# Altium schematic sheet AFE.SchDoc
size A4; SheetNumber: 3; SheetTotal: 5
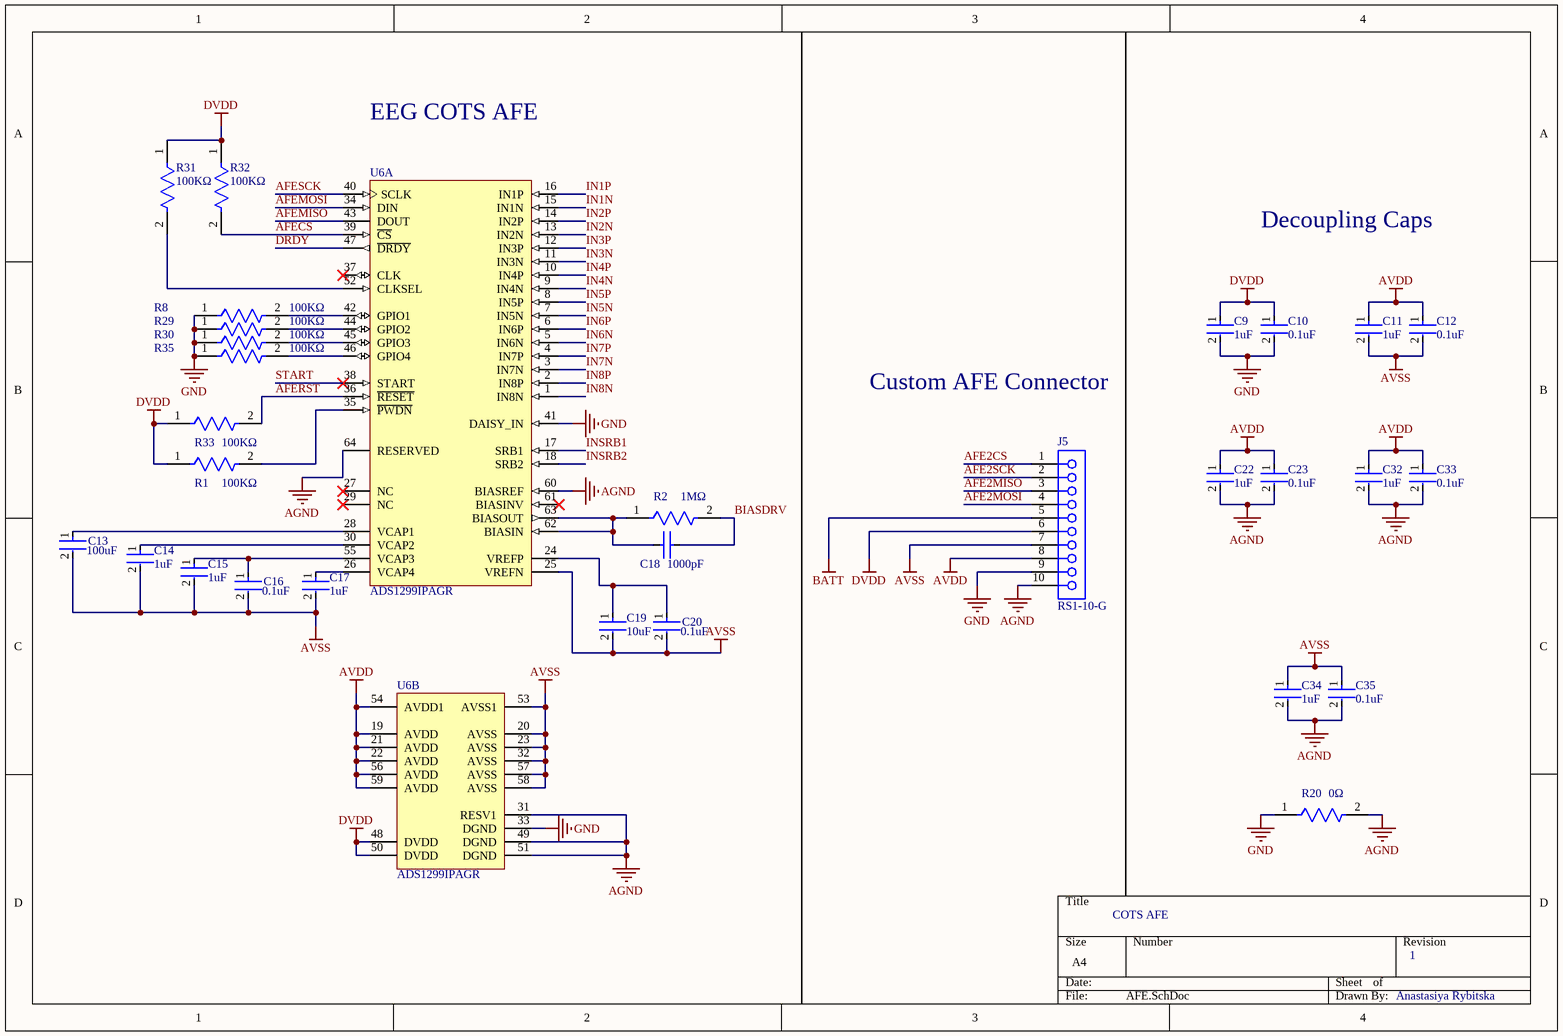
[diagram p0: AFE.SchDoc]

## Parts
C9  Capacitance: 1uF  [FP-CL10-IPC_C]  (hidden comment: CL10A105KA8NNNC)
C10  Capacitance: 0.1uF  [FP-0603-L_1_6_0_15-W_0_81-MFG]  (hidden comment: KGM15BR71H104JT)
C11  Capacitance: 1uF  [FP-CL10-IPC_C]  (hidden comment: CL10A105KA8NNNC)
C12  Capacitance: 0.1uF  [FP-0603-L_1_6_0_15-W_0_81-MFG]  (hidden comment: KGM15BR71H104JT)
C13  Capacitance: 100uF  [FP-GRM21B-0_2-e0_2_0_7-IPC_A]  (hidden comment: GRM21BR60E107ME15K)
C14  Capacitance: 1uF  [FP-CL10-IPC_C]  (hidden comment: CL10A105KA8NNNC)
C15  Capacitance: 1uF  [FP-CL10-IPC_C]  (hidden comment: CL10A105KA8NNNC)
C16  Capacitance: 0.1uF  [FP-0603-L_1_6_0_15-W_0_81-MFG]  (hidden comment: KGM15BR71H104JT)
C17  Capacitance: 1uF  [FP-CL10-IPC_C]  (hidden comment: CL10A105KA8NNNC)
C18  Capacitance: 1000pF  [CAP_0603_S_WAL]  (hidden comment: 0603N102F500CT)
C19  Capacitance: 10uF  [FP-CL10-IPC_C]  (hidden comment: CL10A106MQ8NNNC)
C20  Capacitance: 0.1uF  [FP-0603-L_1_6_0_15-W_0_81-MFG]  (hidden comment: KGM15BR71H104JT)
C22  Capacitance: 1uF  [FP-CL10-IPC_C]  (hidden comment: CL10A105KA8NNNC)
C23  Capacitance: 0.1uF  [FP-0603-L_1_6_0_15-W_0_81-MFG]  (hidden comment: KGM15BR71H104JT)
C32  Capacitance: 1uF  [FP-CL10-IPC_C]  (hidden comment: CL10A105KA8NNNC)
C33  Capacitance: 0.1uF  [FP-0603-L_1_6_0_15-W_0_81-MFG]  (hidden comment: KGM15BR71H104JT)
C34  Capacitance: 1uF  [FP-CL10-IPC_C]  (hidden comment: CL10A105KA8NNNC)
C35  Capacitance: 0.1uF  [FP-0603-L_1_6_0_15-W_0_81-MFG]  (hidden comment: KGM15BR71H104JT)
J5  RS1-10-G  [61301011821]
R1  Resistance: 100KΩ  [FP-RMCF0603-IPC_C]  (hidden comment: RMCF0603FT100K)
R2  Resistance: 1MΩ  [FP-ERJ3EK-IPC_C]  (hidden comment: ERJ-3EKF1004V)
R8  Resistance: 100KΩ  [FP-RMCF0603-IPC_C]  (hidden comment: RMCF0603FT100K)
R20  Resistance: 0Ω  [FP-RMCF0603-MFG]  (hidden comment: RMCF0603ZT0R00)
R29  Resistance: 100KΩ  [FP-RMCF0603-IPC_C]  (hidden comment: RMCF0603FT100K)
R30  Resistance: 100KΩ  [FP-RMCF0603-IPC_C]  (hidden comment: RMCF0603FT100K)
R31  Resistance: 100KΩ  [FP-RMCF0603-IPC_C]  (hidden comment: RMCF0603FT100K)
R32  Resistance: 100KΩ  [FP-RMCF0603-IPC_C]  (hidden comment: RMCF0603FT100K)
R33  Resistance: 100KΩ  [FP-RMCF0603-IPC_C]  (hidden comment: RMCF0603FT100K)
R35  Resistance: 100KΩ  [FP-RMCF0603-IPC_C]  (hidden comment: RMCF0603FT100K)
U6  ADS1299IPAGR  [PAG0064A_M]  (parts A,B of 2)

## Nets
AGND: C22.2 C23.2 C32.2 C33.2 C34.2 C35.2 J5.10 R20.2 U6.31(RESV1) U6.49(DGND) U6.51(DGND) U6.60(BIASREF) U6.64(RESERVED)
AVDD: C11.1 C12.1 C22.1 C23.1 C32.1 C33.1 J5.8 U6.19(AVDD) U6.21(AVDD) U6.22(AVDD) U6.54(AVDD1) U6.56(AVDD) U6.59(AVDD)
AVSS: C11.2 C12.2 C13.2 C14.2 C15.2 C16.2 C17.2 C19.2 C20.2 C34.1 C35.1 J5.7 U6.20(AVSS) U6.23(AVSS) U6.25(VREFN) U6.32(AVSS) U6.53(AVSS1) U6.57(AVSS) U6.58(AVSS)
BATT: J5.5
DVDD: C9.1 C10.1 J5.6 R1.1 R31.1 R32.1 R33.1 U6.48(DVDD) U6.50(DVDD)
GND: C9.2 C10.2 J5.9 R8.1 R20.1 R29.1 R30.1 R35.1 U6.33(DGND) U6.41(DAISY_IN)
AFE2CS: J5.1
AFE2MISO: J5.3
AFE2MOSI: J5.4
AFE2SCK: J5.2
AFECS: R32.2 U6.39(~{CS})
AFEMISO: U6.43(DOUT)
AFEMOSI: U6.34(DIN)
AFERST: R33.2 U6.36(~{RESET})
AFESCK: U6.40(SCLK)
BIASDRV: C18.2 R2.2
DRDY: U6.47(~{DRDY})
IN1N: U6.15(IN1N)
IN1P: U6.16(IN1P)
IN2N: U6.13(IN2N)
IN2P: U6.14(IN2P)
IN3N: U6.11(IN3N)
IN3P: U6.12(IN3P)
IN4N: U6.9(IN4N)
IN4P: U6.10(IN4P)
IN5N: U6.7(IN5N)
IN5P: U6.8(IN5P)
IN6N: U6.5(IN6N)
IN6P: U6.6(IN6P)
IN7N: U6.3(IN7N)
IN7P: U6.4(IN7P)
IN8N: U6.1(IN8N)
IN8P: U6.2(IN8P)
INSRB1: U6.17(SRB1)
INSRB2: U6.18(SRB2)
START: U6.38(START)
NetC13_1: C13.1 U6.28(VCAP1)
NetC14_1: C14.1 U6.30(VCAP2)
NetC15_1: C15.1 C16.1 U6.55(VCAP3)
NetC17_1: C17.1 U6.26(VCAP4)
NetC18_1: C18.1 R2.1 U6.62(BIASIN) U6.63(BIASOUT)
NetC19_1: C19.1 C20.1 U6.24(VREFP)
NetR1_2: R1.2 U6.35(~{PWDN})
NetR8_2: R8.2 U6.42(GPIO1)
NetR29_2: R29.2 U6.44(GPIO2)
NetR30_2: R30.2 U6.45(GPIO3)
NetR31_2: R31.2 U6.52(CLKSEL)
NetR35_2: R35.2 U6.46(GPIO4)

Not connected (* = marked no-connect by the designer): U6 27(NC)* 29(NC)* 37(CLK)* 61(BIASINV)*

## Notes on the sheet
- EEG COTS AFE
- Decoupling Caps
- Custom AFE Connector
- COTS AFE
- 1
- Anastasiya Rybitska

## Library data of the parts
C9 C11 C14 C15 C17 C22 C32 C34 = CMP-13271-004127-1: Cap Ceramic 1uF 25V X5R ±10% Pad SMD 0603 +85°C T/R; Height: 0.8mm; Depth: 0.8mm; Package Quantity: 1; Mount: Surface Mount; Contact Plating: Tin; Voltage Rating: 25V; Dielectric: X5R; Packaging: Tape and Reel; Material: Ceramic; Case Code (Metric): 1608; Length: 1.6mm; Voltage: 25V; Min Operating Temperature: -55°C; Width: 0.031inch; Tolerance: 10%; Case/Package: 0603; Radiation Hardening: No; Case Code (Imperial): 0603; Thickness: 0.035inch; Lead Free: Lead Free; Max Operating Temperature: 85°C; Voltage Rating (DC): 25V
C10 C12 C16 C20 C23 C33 C35 = CMP-07738-136560482-1: KGM15BR71H104JT Cap Cer 0.1UF 50V X7R 0603; Material: Ceramic; Tolerance: 5%; NexarPartId: 136560482; Height: 940µm; Voltage Rating: 50V; Case/Package: 0603; Max Operating Temperature: 125°C; Min Operating Temperature: -55°C
C13 = CMP-06035-026524-1: Chip Multilayer Ceramic Capacitors for General Purpose, 0805, 100uF, X5R, 15%, 20%, 2.5V; Tolerance: 20%; Width: 1.25mm; Dielectric: X5R; Voltage Rating (DC): 2.5V; Thickness: 1.25mm; Length: 2mm
C18 = 0603N102F500CT: No Description Available; Mfr_Name: Walsin; Type: DEV; Copyright: Copyright (C) 2023 Ultra Librarian. All rights reserved.; Manufacturer_Part_Number: 0603N102F500CT; RefDes: RefDes
C19 = CMP-13271-001938-1: Cap Ceramic 10uF 6.3V X5R ±20% Pad SMD 0603 +85°C T/R; Contact Plating: Tin; Height: 0.8mm; Width: 0.031inch; Min Operating Temperature: -55°C; Dielectric: X5R; Voltage Rating: 6.3V; Case/Package: 0603; Package Quantity: 1; Radiation Hardening: No; Packaging: Tape and Reel; Max Operating Temperature: 85°C; Voltage: 6.3V; Thickness: 0.035inch; Mount: Surface Mount; Case Code (Imperial): 0603; Case Code (Metric): 1608; Depth: 0.8mm; Tolerance: 20%; Length: 1.6mm
J5 = CMP-1502-01332-2: NexarPartId: 18818160; Insulation: Insulated; Pitch: 2.54mm; Insulation Resistance: 1GΩ; Gender: Female; Contact Resistance: 20mΩ; Current Rating: 3A; Number of Positions: 10; Connector Type: Header, Socket; Operating Supply Voltage: 250V; Flammability Rating: UL94 V-0; RoHS: Compliant; Max Operating Temperature: 125°C; Length: 25.9mm; Contact Gender: Female; Contact Plating: Gold; REACH SVHC: Unknown; Number of Pins: 10; Number of Rows: 1; Termination: Through Hole; Orientation: Vertical; Contact Material: Copper; Color: Black; Mount: Through Hole; Width: 25.9mm; Height: 8.5mm; Number of Contacts: 10; Housing Material: PBT; Lead Free: Lead Free; Lead Pitch: 2.54mm; Min Operating Temperature: -40°C; Voltage Rating: 250V
R1 R8 R29-R33 R35 = CMP-2000-06989-2: 100kΩ ±1% 0.1W 0603 Thick Film Chip Resistor AEC-Q200 compliant; Working Voltage: 75V; Max Power Dissipation: 100mW; Temperature Coefficient: 100ppm/°C; Height: 0.022inch; Construction: Rectangular; Lead Free: Lead Free; Tolerance: 1%; Features: Automotive AEC-Q200; Packaging: Tape and Reel; Number of Terminations: 2; Mount: Surface Mount; Case Code (Imperial): 0603; Case/Package: 0603; Resistor Type: Thick Film; Radiation Hardening: No; Power Rating: 100mW; Max Operating Temperature: 155°C; Length: 1.55mm; Width: 0.031inch; Military Standard: Not; RoHS Compliant: Yes; Min Operating Temperature: -55°C; Series: RMCF; Depth: 0.8mm; Case Code (Metric): 1608; Contact Plating: Tin
R2 = CMP-1012-00849-3: RES SMD 1M OHM 1% 1/10W 0603; Voltage Rating: 75V; Temperature Coefficient: 100ppm/°C; Power Rating: 100mW; REACH SVHC: No SVHC; Radiation Hardening: No; Features: Automotive AEC-Q200; Case Code (Metric): 1608; Resistance Tolerance: 1%; Case/Package: 0603; Termination: SMD/SMT; Max Operating Temperature: 155°C; Tolerance: 1%; Size Code: 0603; Case Code (Imperial): 0603; Min Operating Temperature: -55°C; Number of Pins: 2; Mount: Surface Mount; Package Quantity: 1; Military Standard: Not; Voltage Rating (DC): 75V; Depth: 0.8mm; Packaging: Tape and Reel; Width: 0.8mm; Number of Terminations: 2; Length: 1.6mm; Height: 0.022inch; RoHS Compliant: Yes; Resistor Type: Thick Film; Contact Plating: Tin; Lead Free: Lead Free; Series: ERJ; Construction: Rectangular; Max Power Dissipation: 100mW
R20 = CMP-26527-000011-1: RES 0 OHM JUMPER 1/10W 0603; Manufacturer: Stackpole; Power Rating: 0.1W; Voltage Rating: 75V; Automotive Grade: Grade 0; Value: 0mΩ; Series: RMCF; Manufacturer Part Number: RMCF0603ZT0R00; Device Class L1: Passive Components; Device Class L3: Chip SMD Resistors; Octopart: https://octopart.com/rmcf0603zt0r00-stackpole+electronics-19213618; Temperature: -55°C to +155°C; Lead Free: Yes; ComponentLink2URL: https://www.seielect.com/catalog/sei-rmcf_rmcp.pdf; Height: 0.55mm; Composition: Thick Film; Package: RMCF0603; Automotive: Yes; Temperature Range High: +155°C; Ipc Land Pattern Name: RESC15580X45; Digikey Description: RES 0 OHM JUMPER 1/10W 0603; RoHS: TRUE; ComponentLink2Description: Datasheet; Temperature Range Low: -55°C; Category: Res; Device Class L2: Resistors
U6 = CMP-0841-00001-2: Low-Noise, 8-Channel, 24-Bit Analog Front-End for Biopotential Measurement, 16 KSPS, -40 to 85 degC, 64-Pin PQFP (PAG-64), RoHS, Tape and Reel; Manufacturer: Texas Instruments; Architecture: Delta-Sigma; Interface: Serial SPI; # Input Channels: 8; Sample Rate (max) (KSPS): 16; Packing: PAG0064A; Reference Mode: Int, Ext; Resolution (Bits): 24; PackageReference: PAG-64; ComponentLink2Description: Datasheet; Operating Temperature Range (C): -40 to 85; ComponentLink1Description: Manufacturer URL; Mounting Technology: Surface Mount; ComponentLink3Description: Package Specification; PartNumber: ADS1299IPAGR; PackageDescription: 64-Pin Plastic Quad Flatpack, Body 10 x 10 mm, Pitch 0.5 mm; ComponentLink2URL: http://www.ti.com/lit/ds/symlink/ads1299.pdf; PackageVersion: 4040282/C; ComponentLink1URL: http://www.ti.com/; ComponentLink3URL: http://www.ti.com/lit/ml/mtqf006a/mtqf006a.pdf; RoHS: TRUE; DatasheetVersion: SBAS499A